# EAGLE design NixieModule (EAGLE 9.1.3)
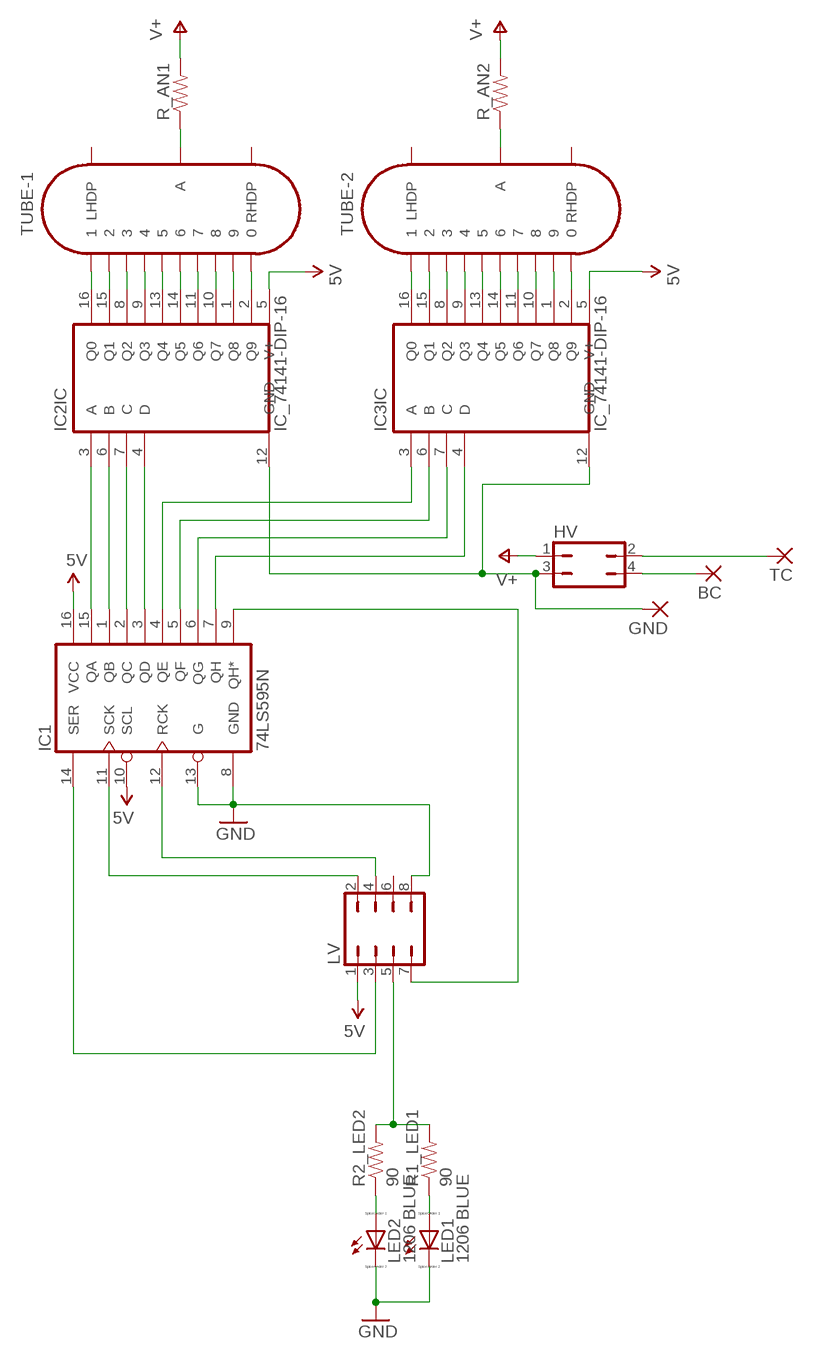
[diagram p0: schematic, sheet 1]

## Parts
BC  1,6/0,9  [1,6/0,9]
GND  1,6/0,9  [1,6/0,9]
HV  JP2Q  [JP2Q]
IC1  74LS595N  [DIL16]
IC2  IC_74141-DIP-16  [DIL16]
IC3  IC_74141-DIP-16  [DIL16]
LED1  1206 BLUE  LED_E  [LED_1206]
LED2  1206 BLUE  LED_E  [LED_1206]
LV  JP4Q  [JP4Q]
R1_LED1  90  RESISTORPTH-1/4W  [AXIAL-0.4]
R2_LED2  90  RESISTORPTH-1/4W  [AXIAL-0.4]
R_AN1  RESISTORPTH-1/4W  [AXIAL-0.4]
R_AN2  RESISTORPTH-1/4W  [AXIAL-0.4]
TC  1,6/0,9  [1,6/0,9]
TUBE-1  IN-14  [IN-14]
TUBE-2  IN-14  [IN-14]

## Nets
5V: IC1.16(VCC) IC2.5(SUPPLY:V+) IC3.5(SUPPLY:V+) LV.1
GND [High Voltage 170V]: GND.1(P) HV.3 IC1.8(GND) IC1.13(G) IC2.12(SUPPLY:GND) IC3.12(SUPPLY:GND) LED1.C LED2.C LV.8
N$1 [High Voltage 170V]: R_AN1.P$1 TUBE-1.A
N$2 [High Voltage 170V]: R_AN2.P$1 TUBE-2.A
N$3: IC1.12(RCK) LV.4
N$4: IC1.11(SCK) LV.2
N$5: IC1.14(SER) LV.3
N$6: LED2.A R2_LED2.P$1
N$7: IC2.16(IC:Q0) TUBE-1.1
N$8 [High Voltage 60V]: IC2.15(IC:Q1) TUBE-1.2
N$9 [High Voltage 60V]: IC2.8(IC:Q2) TUBE-1.3
N$10 [High Voltage 60V]: IC2.9(IC:Q3) TUBE-1.4
N$11 [High Voltage 60V]: IC2.13(IC:Q4) TUBE-1.5
N$12 [High Voltage 60V]: IC2.14(IC:Q5) TUBE-1.6
N$13 [High Voltage 60V]: IC2.11(IC:Q6) TUBE-1.7
N$14 [High Voltage 60V]: IC2.10(IC:Q7) TUBE-1.8
N$15 [High Voltage 60V]: IC2.1(IC:Q8) TUBE-1.9
N$16 [High Voltage 60V]: IC2.2(IC:Q9) TUBE-1.0
N$17 [High Voltage 60V]: IC3.16(IC:Q0) TUBE-2.1
N$18 [High Voltage 60V]: IC3.15(IC:Q1) TUBE-2.2
N$19 [High Voltage 60V]: IC3.8(IC:Q2) TUBE-2.3
N$20 [High Voltage 60V]: IC3.9(IC:Q3) TUBE-2.4
N$21 [High Voltage 60V]: IC3.13(IC:Q4) TUBE-2.5
N$22 [High Voltage 60V]: IC3.14(IC:Q5) TUBE-2.6
N$23 [High Voltage 60V]: IC3.11(IC:Q6) TUBE-2.7
N$24 [High Voltage 60V]: IC3.10(IC:Q7) TUBE-2.8
N$25 [High Voltage 60V]: IC3.1(IC:Q8) TUBE-2.9
N$26 [High Voltage 60V]: IC3.2(IC:Q9) TUBE-2.0
N$27: LED1.A R1_LED1.P$1
N$28: LV.5 R1_LED1.P$2 R2_LED2.P$2
N$29: HV.2 TC.1(P)
N$30: BC.1(P) HV.4
N$71: IC1.1(QB) IC2.6(IC:B)
N$72: IC1.2(QC) IC2.7(IC:C)
N$73: IC1.3(QD) IC2.4(IC:D)
N$74: IC1.15(QA) IC2.3(IC:A)
N$79: IC1.4(QE) IC3.3(IC:A)
N$80: IC1.5(QF) IC3.6(IC:B)
N$81: IC1.6(QG) IC3.7(IC:C)
N$82: IC1.7(QH) IC3.4(IC:D)
N$83: IC1.9(QH*) LV.7
V+ [High Voltage 170V]: HV.1 R_AN1.P$2 R_AN2.P$2
VCC [High Voltage 170V]: IC1.10(SCL) ; supply symbol labelled 5V
Unconnected: LV.6 TUBE-1.LHDP TUBE-1.RHDP TUBE-2.LHDP TUBE-2.RHDP

## Library data of the parts
BC GND TC = wirepad:1,6/0,9: THROUGH-HOLE PAD
HV = jumper:JP2Q: JUMPER
IC1 = SparkFun:74*595: 8-bit SHIFT REGISTER, output latch
IC2 IC3 = dp_devices:IC_74141: BCD to decimal decoder
LED1 LED2 = eagle-ltspice:LED_E: LED Source: http://www.osram.convergy.de Source: www.luxeon.com Source: www.kingbright.com; SPICEMODEL: NONE; SPICEPREFIX: D; SPICETYPE: diode
LV = jumper:JP4Q: JUMPER
R1_LED1 R2_LED2 R_AN1 R_AN2 = SparkFun:RESISTOR: Resistor Basic schematic elements and footprints for 0603, 1206, and PTH resistors.
TUBE-1 TUBE-2 = ScottCustom:IN-14: IN-14: medium numeric frontview nixie tube

## Net classes
0 default: width 0.305 mm, clearance 0.305 mm
1 High Voltage 170V: width 0.61 mm, clearance 0.205 mm to class 0, clearance 0.61 mm
2 High Voltage 60V: width 0.406 mm, clearance 0.205 mm to class 0, clearance 0.205 mm to class 1, clearance 0.406 mm

## Board
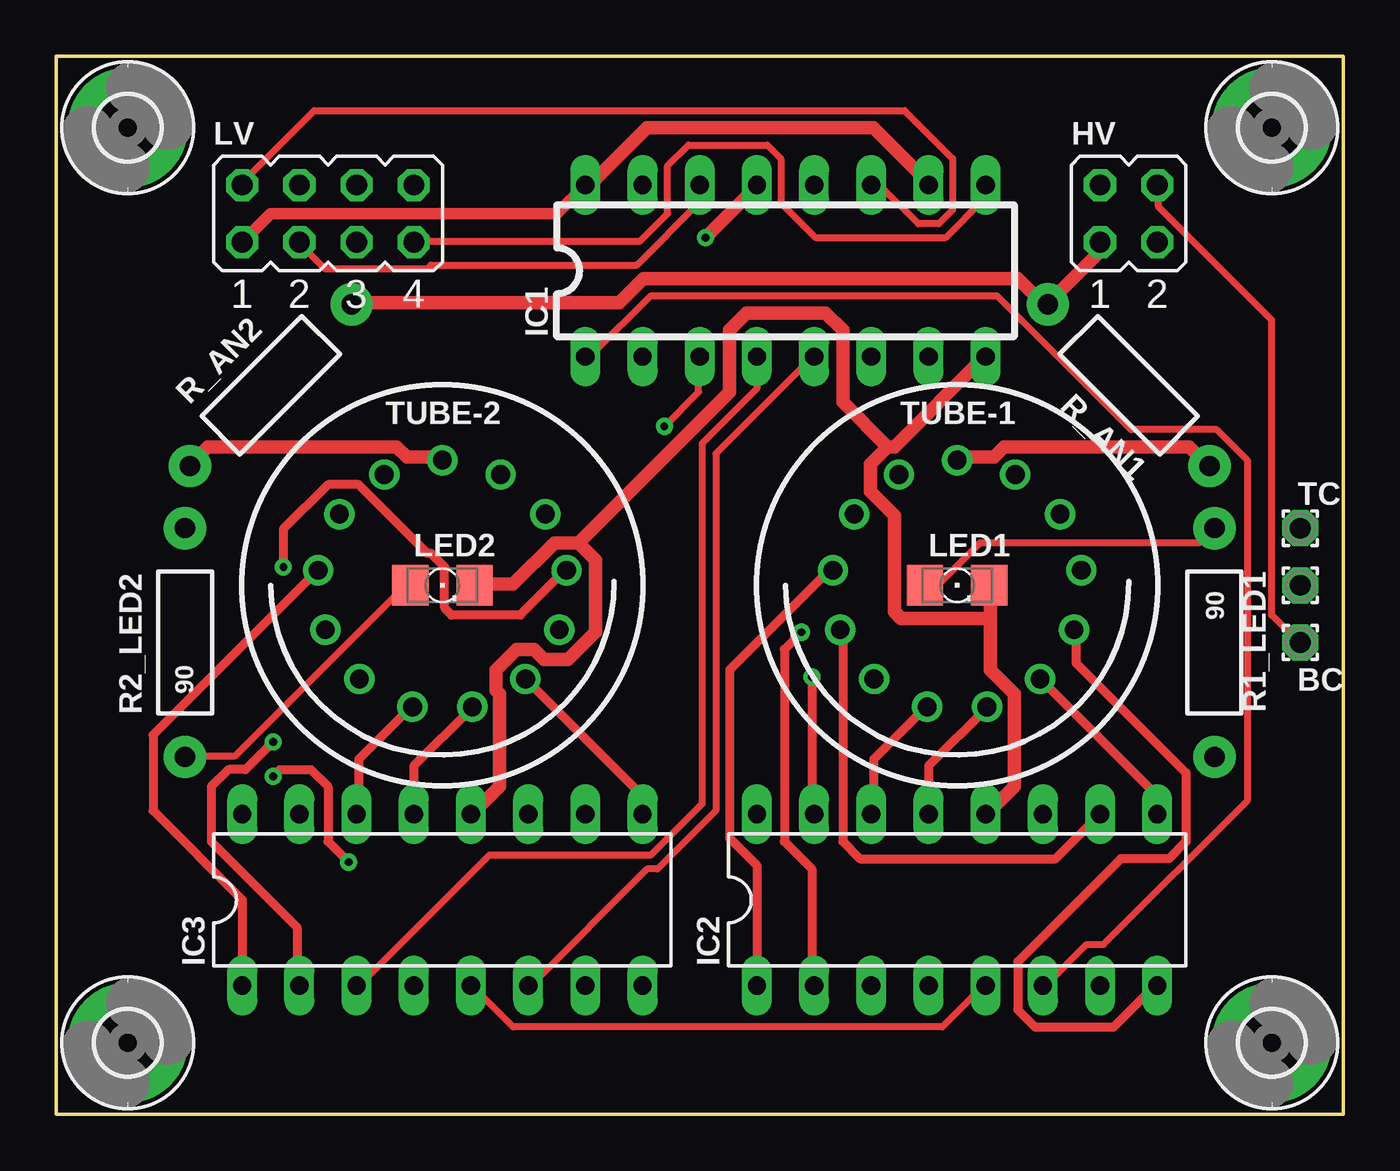
[diagram p1: board, top side]
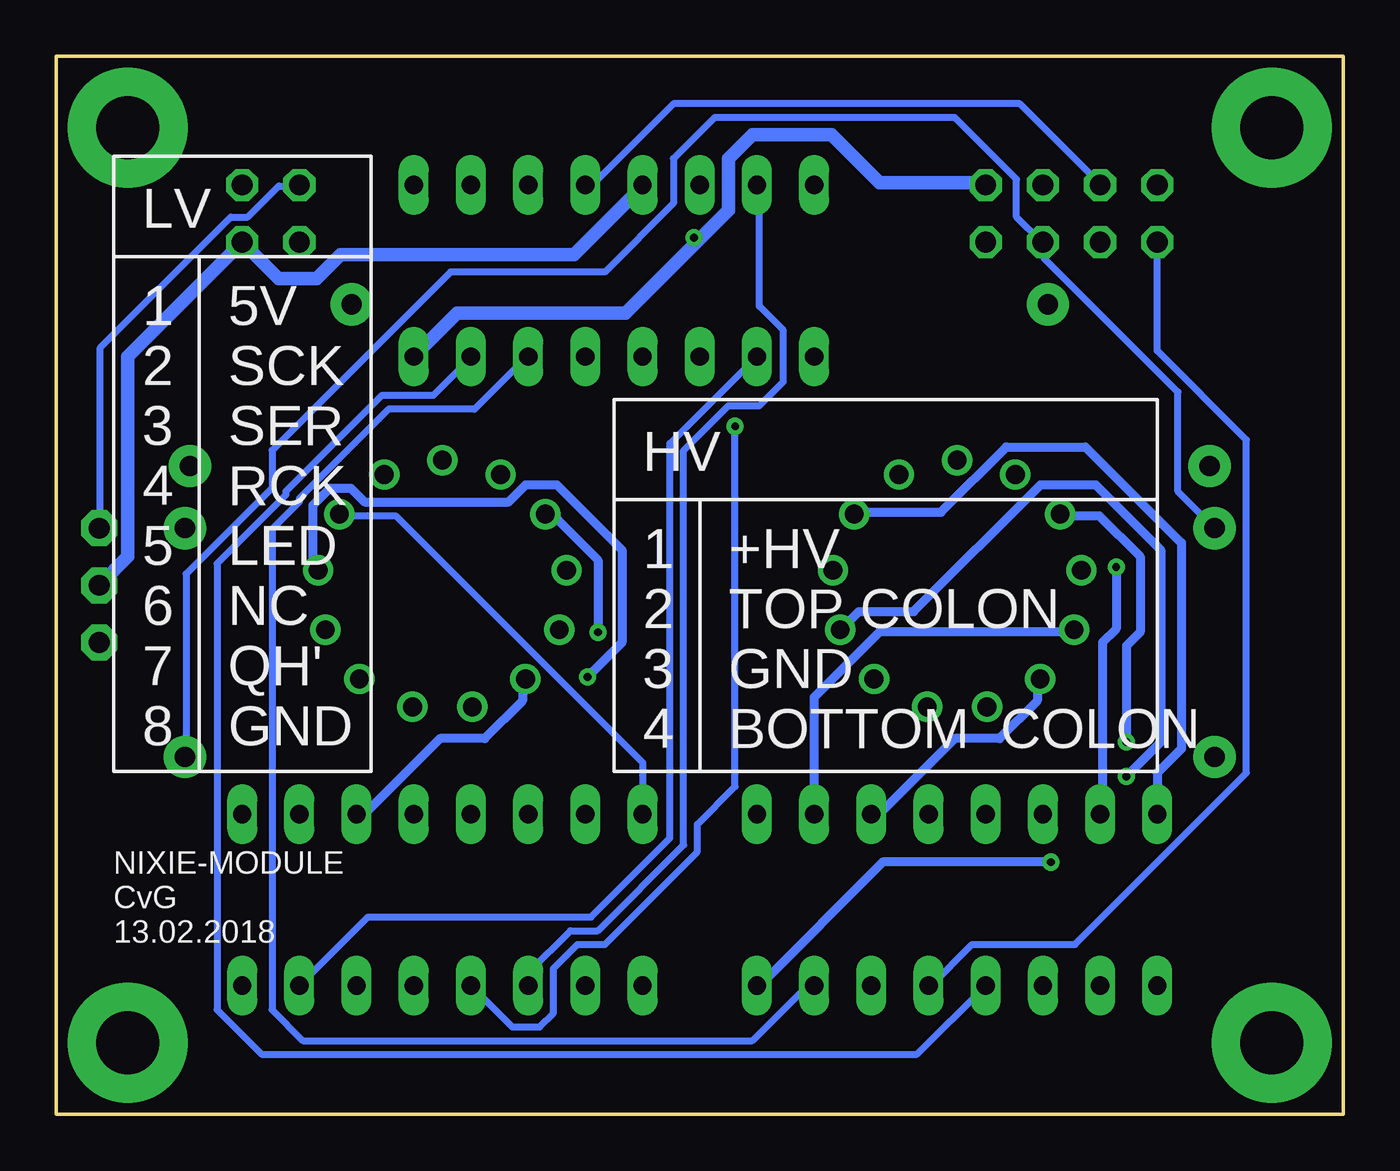
[diagram p2: board, bottom side, seen from below]

Size 57.15 x 46.99 mm. Coordinates in mm from the lower left corner, seen from the top.
Outline: 57.15,0 0,0 0,46.99 57.15,46.99 57.15,0
Copper layers (1*16): Top 0.035mm / dielectric 1.5mm / Bottom 0.035mm
Design rules "NixieModule": minimum track width 6mil, minimum drill 0.35mm, track to track 0.205mm, track to pad 0.205mm, pad to pad 0.205mm, via to via 0.205mm, smd to smd 6mil, copper to edge 40mil, drill to drill 6mil, minimum pad ring 10mil, minimum via ring 8mil, stop-mask expansion 4mil, vias tented up to drill 0mil, thermal gap 10mil

### Footprints (pad centres in the part's own frame; a part is rotated, then mirrored left to right if it is on the bottom)
1,6/0,9 = drill 0.914 pad 1.6 octagon: 1 0,0
2,8-PAD = drill 2.8 pad 5.334: B2,8 0,0
JP2Q = drill 0.914 octagon: 1 -1.27,-1.27; 2 -1.27,1.27; 3 1.27,-1.27; 4 1.27,1.27
DIL16 = drill 0.813 long: 1 -8.89,-3.81; 2 -6.35,-3.81; 3 -3.81,-3.81; 4 -1.27,-3.81; 5 1.27,-3.81; 6 3.81,-3.81; 7 6.35,-3.81; 8 8.89,-3.81; 9 8.89,3.81; 10 6.35,3.81; 11 3.81,3.81; 12 1.27,3.81; 13 -1.27,3.81; 14 -3.81,3.81; 15 -6.35,3.81; 16 -8.89,3.81
LED_1206 = smd 1.6 x 1.803: A -1.422,0; C 1.422,0
JP4Q = drill 0.914 octagon: 1 -3.81,-1.27; 2 -3.81,1.27; 3 -1.27,-1.27; 4 -1.27,1.27; 5 1.27,-1.27; 6 1.27,1.27; 7 3.81,-1.27; 8 3.81,1.27
AXIAL-0.4 = drill 0.9 pad 1.88: P$1 -5.08,0; P$2 5.08,0
IN-14 = drill 0.84: 0 4.572,-3.157; 1 -4.572,-3.157; 2 -5.517,-0.671; 3 -5.194,1.971; 4 -3.686,4.158; 5 -1.331,5.395; 6 1.331,5.395; 7 3.686,4.158; 8 5.194,1.971; 9 5.517,-0.671; A 0,-5.558; LHDP 2.583,-4.92; RHDP -2.583,-4.92

### Placement (x,y rotation side)
BC  55.24,20.95 0 top
GND  55.24,23.5 0 top
H1  MOUNT-PAD-ROUND2.8  [2,8-PAD]  3.17,3.17 0 top
H2  MOUNT-PAD-ROUND2.8  [2,8-PAD]  53.98,3.17 0 top
H3  MOUNT-PAD-ROUND2.8  [2,8-PAD]  3.17,43.81 0 top
H4  MOUNT-PAD-ROUND2.8  [2,8-PAD]  53.98,43.81 0 top
HV  47.62,40 0 top
IC1  32.38,37.47 0 top
IC2  40,9.52 0 top
IC3  17.15,9.52 0 top
LED1  40,23.5 0 top
LED2  17.15,23.5 0 top
LV  12.06,40 0 top
R1_LED1  51.43,20.95 270 top
R2_LED2  5.71,20.95 90 top
R_AN1  47.62,32.39 135 top
R_AN2  9.53,32.39 45 top
TC  55.24,26.03 0 top
TUBE-1  40,23.5 180 top
TUBE-2  17.15,23.5 180 top

### Tracks (layer width: path | path; a pad name or v marks a point on that pad's centre or on a via)
5V
  Top 0.305: IC3.5 18.47,5.72 20.3,3.89 39.34,3.89 41.17,5.72 IC2.5
  Top 0.508: IC1.16 22.23,40 9.53,40 LV.1
  Bottom 0.305: LV.1 8.26,33.91 4.29,29.95 4.29,15.16 11.91,7.54 16.48,7.54 18.31,5.72 IC3.5
GND  (via drill 0.35)
  Top 0.61: 23.19,25.38 22.12,25.38 20.3,23.55 18.62,23.55 LED2.C | 23.19,25.38 23.95,24.61 23.95,21.41 22.73,20.19 21.67,20.19 21.21,20.65 20.45,20.65 19.53,19.74 19.53,18.82 19.69,18.67 19.69,14.55 18.47,13.34 IC3.12 | 41.48,22.02 41.48,19.74 42.54,18.67 42.54,14.55 41.33,13.34 IC2.12 | 41.48,22.02 41.48,23.39 LED1.C | 36.91,29.64 37.21,29.64 41.17,33.6 IC1.8 | 36.91,29.64 36.14,28.88 36.14,27.66 37.21,26.59 37.21,22.33 37.52,22.02 41.48,22.02 | 23.19,25.38 29.9,32.08 29.9,34.82 30.66,35.58 34.16,35.58 34.92,34.82 34.92,31.62 36.91,29.64 | v28.83,38.94 31.12,41.22 IC1.13
  Bottom 0.61: IC1.13 31.12,41.22 34.16,38.18 44.53,38.18 45.59,37.11 47.27,37.11 HV.3 53.98,33.66 53.98,24.77 GND.1 | 28.68,38.79 31.88,35.58 39.34,35.58 IC1.8 | 28.68,38.79 27.31,40.16 27.31,42.44 26.24,43.51 22.73,43.51 20.6,41.38 15.88,41.38 LV.8 | v28.83,38.94 28.68,38.79
N$1
  Top 0.61: TUBE-1.A 40.11,29.19 41.63,29.19 42.09,29.64 50.32,29.64 51.08,28.88 R_AN1.P$1
N$2
  Top 0.61: TUBE-2.A 17.09,29.19 15.57,29.19 15.11,29.64 6.73,29.64 5.97,28.88 R_AN2.P$1
N$3
  Bottom 0.305: IC1.12 33.55,41.38 33.25,41.38 29.74,44.88 14.35,44.88 10.85,41.38 LV.4
N$4
  Top 0.305: IC1.11 36.3,41.22 36.6,41.22 38.28,39.55 39.19,39.55 39.8,40.16 39.8,42.44 37.67,44.58 11.46,44.58 8.26,41.38 LV.2
N$5
  Top 0.305: IC1.14 28.52,41.22 28.52,40.46 25.78,37.72 16.64,37.72 16.48,37.57 11.91,37.57 10.85,38.63 LV.3
N$6
  Top 0.305: LED2.A 15.72,23.39 15.42,23.39 7.95,15.93 5.82,15.93 R2_LED2.P$1
N$7
  Bottom 0.305: IC2.16 31.12,15.62 42.09,26.59 44.53,26.59 TUBE-1.1
N$8  (via drill 0.35)
  Top 0.406: v33.55,19.43 33.55,13.34 IC2.15
  Bottom 0.406: v33.55,19.43 32.03,20.95 32.03,25.07 34.92,27.97 36.3,27.97 37.06,27.2 43.46,27.2 44.07,27.81 44.98,27.81 45.74,27.05 45.74,24.46 45.59,24.31 TUBE-1.2
N$9
  Top 0.406: IC2.8 48.79,5.72 46.96,3.89 43.46,3.89 42.7,4.65 42.7,6.78 47.27,11.35 49.4,11.35 50.16,12.12 50.16,15.16 45.29,20.04 45.29,21.41 TUBE-1.3
N$10
  Top 0.406: IC2.9 48.79,13.34 48.79,14.25 43.76,19.28 TUBE-1.4
N$11
  Top 0.406: IC2.13 38.73,15.47 41.33,18.06 TUBE-1.5
N$12
  Top 0.406: IC2.14 36.3,13.34 36.3,15.77 38.58,18.06 TUBE-1.6
N$13
  Bottom 0.406: IC2.11 43.46,13.34 40.11,16.69 38.12,16.69 36.45,18.36 36.45,19.28 TUBE-1.7
N$14
  Top 0.406: IC2.10 44.37,11.35 35.69,11.35 34.92,12.12 34.92,21.41 TUBE-1.8
N$15
  Top 0.406: IC2.1 31.12,11.05 29.9,12.27 29.9,19.74 34.47,24.31 TUBE-1.9
N$16  (via drill 0.35)
  Top 0.406: v33.1,21.41 32.33,20.65 32.33,12.12 33.55,10.9 33.55,5.72 IC2.2
  Bottom 0.406: v33.1,21.41 33.1,24.61 35.08,26.59 35.38,26.59 TUBE-1.0
N$17
  Bottom 0.406: IC3.16 8.26,15.16 7.19,16.23 7.19,25.38 11.46,29.64 14.96,29.64 17.86,26.75 21.67,26.75 TUBE-2.1
N$18  (via drill 0.35)
  Top 0.406: v10.08,24.31 10.08,25.98 12.06,27.97 13.44,27.97 16.48,24.92 16.64,24.92 17.25,24.31 17.25,22.48 17.55,22.17 20.6,22.17 22.58,24.16 TUBE-2.2
  Bottom 0.406: v10.08,24.31 10.08,21.56 10.69,20.95 10.69,13.34 IC3.15
N$19  (via drill 0.35)
  Top 0.406: v12.98,11.2 12.06,12.12 12.06,14.55 11.3,15.32 9.93,15.32 v9.63,15.01
  Bottom 0.406: v12.98,11.2 20.45,11.2 25.93,5.72 IC3.8 | v9.63,15.01 8.1,16.53 8.1,25.07 11,27.97 13.44,27.97 19.08,22.33 21.51,22.33 22.28,21.56 TUBE-2.3
N$20
  Top 0.406: IC3.9 25.93,13.34 25.93,14.25 20.9,19.28 TUBE-2.4
N$21
  Top 0.406: IC3.13 15.88,15.47 18.47,18.06 TUBE-2.5
N$22
  Top 0.406: IC3.14 13.44,13.34 13.44,15.77 15.72,18.06 TUBE-2.6
N$23
  Bottom 0.406: IC3.11 20.6,13.34 17.25,16.69 15.27,16.69 13.59,18.36 13.59,19.28 TUBE-2.7
N$24
  Bottom 0.406: IC3.10 23.5,18.52 20.6,21.41 12.06,21.41 TUBE-2.8
N$25
  Top 0.406: IC3.1 8.26,9.52 4.29,13.49 4.29,16.84 11.61,24.16 TUBE-2.9
N$26  (via drill 0.35)
  Top 0.406: v9.63,16.53 8.41,15.32 7.64,15.32 6.88,14.55 6.88,12.12 10.69,8.31 10.69,5.72 IC3.2
  Bottom 0.406: v9.63,16.53 9.63,20.8 9.02,21.41 9.02,24.77 10.85,26.59 12.52,26.59 TUBE-2.0
N$27
  Top 0.305: R1_LED1.P$1 50.77,25.38 41.02,25.38 39.19,23.55 38.73,23.55 LED1.A
N$28
  Bottom 0.305: R2_LED2.P$2 7.34,27.66 7.34,32.08 13.28,38.02 13.28,38.63 LV.5 13.44,38.79 14.5,39.85 14.5,41.53 17.25,44.27 27.92,44.27 29.74,42.44 29.74,40.46 32.79,37.41 39.65,37.41 47.57,29.49 47.57,27.81 51.38,24 51.38,15.93 R1_LED1.P$2
N$29
  Bottom 0.305: HV.2 46.35,41.22 47.27,41.22 48.64,39.85 49.4,39.85 55.19,34.06 55.19,26.14 TC.1
N$30
  Top 0.305: HV.4 48.95,41.22 48.95,40.31 53.98,35.28 53.98,22.17 55.19,20.95 BC.1
N$71
  Top 0.305: IC1.1 23.5,33.76 23.8,33.76 26.39,36.35 41.78,36.35 47.73,30.4 51.54,30.4 52.91,29.03 52.91,13.95 46.51,7.54 45.74,7.54 43.92,5.72 IC2.6
N$72
  Bottom 0.305: IC1.2 29.9,29.79 29.9,12.27 33.4,8.76 43.31,8.76 IC2.7
N$73  (via drill 0.35)
  Top 0.305: v27,30.56 28.52,32.08 28.52,33.6 IC1.3
  Bottom 0.305: v27,30.56 27,14.55 28.68,12.88 28.68,11.66 32.79,7.54 34.01,7.54 35.08,6.48 35.08,4.5 35.69,3.89 36.91,3.89 IC2.4
N$74
  Bottom 0.305: IC1.15 25.93,41.22 25.93,35.89 24.87,34.82 24.87,32.54 25.93,31.47 27.31,31.47 29.29,29.49 29.29,11.96 33.1,8.15 34.31,8.15 36.14,6.33 36.14,5.72 IC2.3
N$79
  Top 0.305: IC1.4 31.12,32.23 28.68,29.79 28.68,13.79 26.39,11.51 19.23,11.51 13.44,5.72 IC3.3
N$80
  Top 0.305: IC3.6 21.06,5.72 26.24,10.9 26.7,10.9 29.29,13.49 29.29,29.34 33.55,33.6 IC1.5
N$81
  Bottom 0.305: IC3.7 23.8,5.72 26.24,3.28 46.2,3.28 47.57,4.65 47.57,25.98 46.35,27.2 46.35,27.36 42.39,31.32 38.58,31.32 36.3,33.6 IC1.6
N$82
  Bottom 0.305: IC3.4 18.92,2.67 48.03,2.67 50.01,4.65 50.01,24.46 46.96,27.51 46.96,27.66 42.7,31.93 40.41,31.93 38.73,33.6 IC1.7
N$83
  Top 0.305: IC1.9 41.17,41.22 41.17,40.61 39.5,38.94 33.71,38.94 32.18,40.46 32.18,42.44 31.57,43.05 28.07,43.05 27.15,42.14 27.15,40 25.93,38.79 15.88,38.79 LV.7
V+
  Top 0.61: HV.1 46.35,38.33 44.07,36.04 R_AN1.P$2 43.76,36.04 42.7,37.11 26.09,37.11 25.02,36.04 13.13,36.04 R_AN2.P$2
VCC
  Top 0.61: 23.5,41.38 23.8,41.38 26.24,43.81 36.3,43.81 38.73,41.38 IC1.10

### Text on the board
bNames: LV | 5V / SCK / SER / RCK / LED / NC / QH' / GND | 1 / 2 / 3 / 4 / 5 / 6 / 7 / 8 | HV | +HV / TOP COLON / GND / BOTTOM COLON | 1 / 2 / 3 / 4 | NIXIE-MODULE / CvG / 13.02.2018